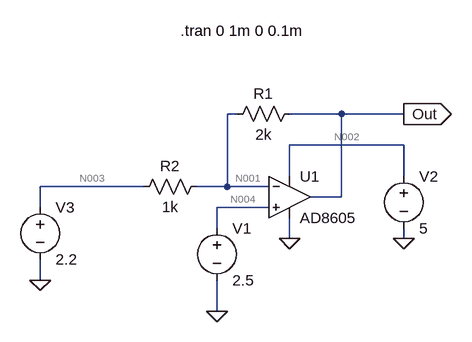
[diagram p0: schematic Draft1.asc]
Draft1.asc, the LTspice schematic file:
Version 4
SHEET 1 880 680
WIRE 96 -32 80 -32
WIRE 256 -32 176 -32
WIRE 352 -32 256 -32
WIRE 352 16 176 16
WIRE 176 64 176 16
WIRE 352 64 352 16
WIRE -48 80 -208 80
WIRE 80 80 80 -32
WIRE 80 80 32 80
WIRE 144 80 80 80
WIRE 256 96 256 -32
WIRE 256 96 208 96
WIRE -208 112 -208 80
WIRE 144 112 64 112
WIRE 64 144 64 112
WIRE 176 160 176 128
WIRE 352 160 352 144
WIRE -208 224 -208 192
WIRE 64 272 64 224
FLAG 64 272 0
FLAG 176 160 0
FLAG 352 160 0
FLAG 352 -32 Out
IOPIN 352 -32 Out
FLAG -208 224 0
SYMBOL Opamps\\AD8605 176 32 R0
SYMATTR InstName U1
SYMBOL voltage 64 128 R0
SYMATTR InstName V1
SYMATTR Value 2.5
SYMBOL voltage 352 48 R0
SYMATTR InstName V2
SYMATTR Value 5
SYMBOL res 192 -48 R90
WINDOW 0 0 56 VBottom 2
WINDOW 3 32 56 VTop 2
SYMATTR InstName R1
SYMATTR Value 2k
SYMBOL res 48 64 R90
WINDOW 0 0 56 VBottom 2
WINDOW 3 32 56 VTop 2
SYMATTR InstName R2
SYMATTR Value 1k
SYMBOL voltage -208 96 R0
SYMATTR InstName V3
SYMATTR Value 2.2
TEXT 8 -160 Left 2 !.tran 0 1m 0 0.1m

The netlist it stands for:
* Draft1.asc
XU1 N004 N001 N002 0 Out AD8605  ; pins In+ In- V+ V- OUT
V1 N004 0 2.5
V2 N002 0 5
R1 Out N001 2k
R2 N001 N003 1k
V3 N003 0 2.2
.tran 0 1m 0 0.1m
.lib ADI.lib
.backanno
.end

* Results of the author's LTspice run, read from the files saved beside the schematic
* Operating Point, zero values left out:
*   V(n001) = 2.5 V
*   V(n002) = 5 V
*   V(n004) = 2.5 V
*   V(out) = 3.1 V
*   V(n003) = 2.2 V
*   I(R2) = 299.9 µA
*   I(R1) = 299.9 µA
*   I(V3) = 299.9 µA
*   I(V2) = -741.5 µA
*   Ix(u1:99) = 741.5 µA
*   Ix(u1:50) = -441.6 µA
*   Ix(u1:45) = -299.9 µA